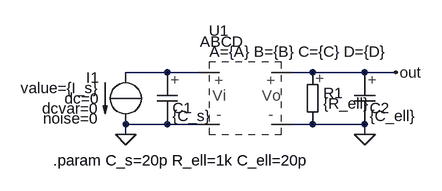
[diagram p0: schematic transimpedanceSpec.asc]
transimpedanceSpec.asc, the LTspice schematic file:
Version 4
SHEET 1 880 680
WIRE 96 112 32 112
WIRE 144 112 96 112
WIRE 320 112 288 112
WIRE 400 112 320 112
WIRE 448 112 400 112
WIRE 96 192 32 192
WIRE 144 192 96 192
WIRE 320 192 288 192
WIRE 400 192 320 192
WIRE 32 208 32 192
WIRE 400 208 400 192
FLAG 32 208 0
FLAG 448 112 out
FLAG 400 208 0
SYMBOL SLABCD 224 96 R0
WINDOW 38 -45 -31 Center 2
WINDOW 3 -63 -16 Left 2
SYMATTR Value A={A} B={B} C={C} D={D}
SYMATTR InstName U1
SYMBOL SLC 96 112 R0
SYMATTR InstName C1
SYMATTR Value {C_s}
SYMBOL SLI 32 112 M0
SYMATTR InstName I1
SYMATTR Value value={I_s}
SYMBOL SLR 320 112 R0
SYMATTR InstName R1
SYMATTR Value {R_ell}
SYMBOL SLC 400 112 R0
SYMATTR InstName C2
SYMATTR Value {C_ell}
TEXT -80 248 Left 2 !.param C_s=20p R_ell=1k C_ell=20p

The netlist it stands for:
* transimpedanceSpec.asc
XU1 out 0 N001 0 ABCD A={A} B={B} C={C} D={D}  ; pins + - NC+ NC-
C1 N001 0 {C_s}
I1 N001 0 I value={I_s} dc=0 dcvar=0 noise=0
R1 out 0 {R_ell}
C2 out 0 {C_ell}
.param C_s=20p R_ell=1k C_ell=20p
.lib SLiCAP.lib
.backanno
.end